# Altium schematic sheet TMC2208.SchDoc
size Letter; SheetNumber: 3; SheetTotal: 3
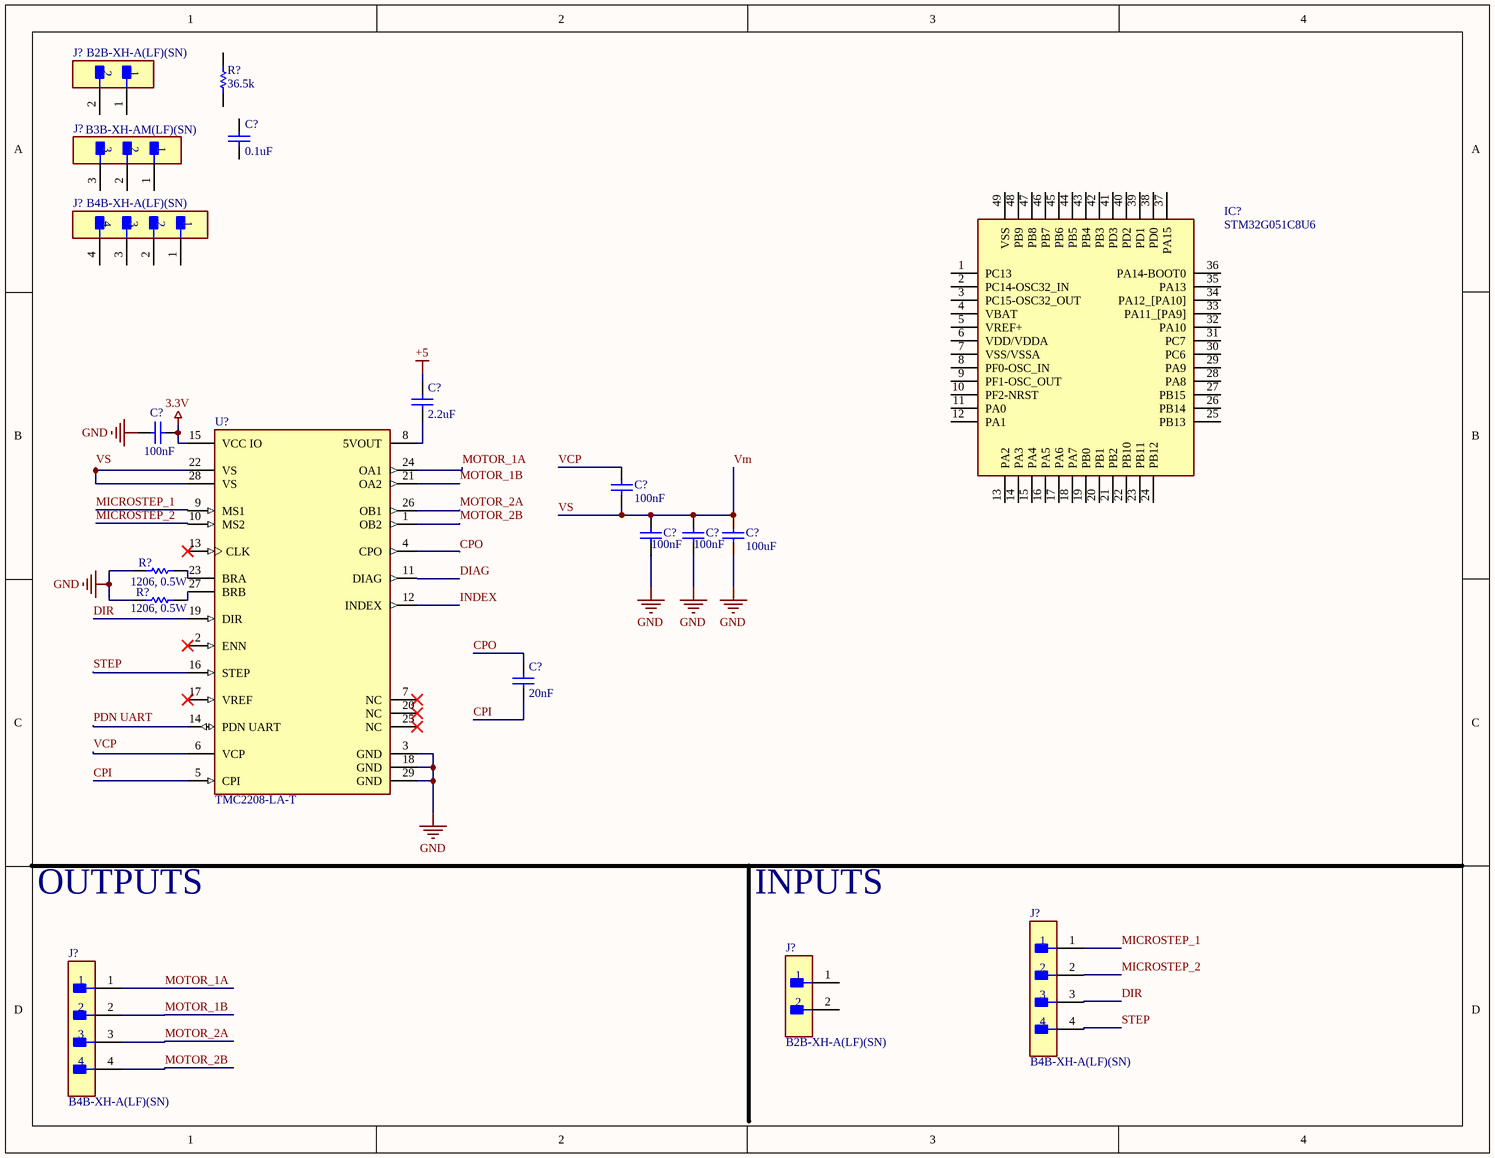
[diagram p0: TMC2208.SchDoc]

## Parts
(Parts that share a designator on the sheet are numbered #1, #2 ... from top to bottom, then left to right.)
C?#1  value 0.1uF  (hidden comment: Capacitor)
C?#2  value 2.2uF  (hidden comment: Capacitor)
C?#3  value 100nF  (hidden comment: Capacitor)
C?#4  value 100nF  (hidden comment: Capacitor)
C?#5  value 100nF  (hidden comment: Capacitor)
C?#6  value 100nF  (hidden comment: Capacitor)
C?#7  value 100uF  (hidden comment: Capacitor)
C?#8  value 20nF  (hidden comment: Capacitor)
IC?  STM32G051C8U6  [QFN50P700X700X65-49N-D]
J?#1  B2B-XH-A(LF)(SN)  [FP-B2B-XH-A_LF_SN-MFG]
J?#2  B3B-XH-AM(LF)(SN)  [FP-B3B-XH-AM_LF_SN-MFG]
J?#3  B4B-XH-A(LF)(SN)  [FP-B4B-XH-A_LF_SN-MFG]
J?#4  B4B-XH-A(LF)(SN)  [FP-B4B-XH-A_LF_SN-MFG]
J?#5  B2B-XH-A(LF)(SN)  [FP-B2B-XH-A_LF_SN-MFG]
J?#6  B4B-XH-A(LF)(SN)  [FP-B4B-XH-A_LF_SN-MFG]
R?#1  value 36.5k  (hidden comment: Resistor)
R?#2  value 1206, 0.5W  (hidden comment: Resistor)
R?#3  value 1206, 0.5W  (hidden comment: Resistor)
U?  TMC2208-LA-T  [FP-TMC2208-LA-T-MFG]

## Nets
3.3V: C?#3.1 U?.15(VCC_IO)
+5: C?#2.2
GND: C?#3.2 C?#5.2 C?#6.2 C?#7.2 R?#2.2 R?#3.1 U?.3(GND) U?.18(GND) U?.29(GND)
CPI: C?#8.1 U?.5(CPI)
CPO: C?#8.2 U?.4(CPO)
DIAG: U?.11(DIAG)
DIR: J?#4.3 U?.19(DIR)
INDEX: U?.12(INDEX)
MICROSTEP_1: J?#4.1 U?.9(MS1)
MICROSTEP_2: J?#4.2 U?.10(MS2)
MOTOR_1A: J?#6.1 U?.24(OA1)
MOTOR_1B: J?#6.2 U?.21(OA2)
MOTOR_2A: J?#6.3 U?.26(OB1)
MOTOR_2B: J?#6.4 U?.1(OB2)
PDN UART: U?.14(PDN_UART)
STEP: J?#4.4 U?.16(STEP)
VCP: C?#4.1 U?.6(VCP)
Vm: C?#4.2 C?#5.1 C?#6.1 C?#7.1 U?.22(VS) U?.28(VS)  [also labelled VS]
NetC?#2_1: C?#2.1 U?.8(5VOUT)
NetR?#2_1: R?#2.1 U?.23(BRA)
NetR?#3_2: R?#3.2 U?.27(BRB)

Not connected (* = marked no-connect by the designer): C?#1 1 2; IC? 1(PC13) 2(PC14-OSC32_IN) 3(PC15-OSC32_OUT) 4(VBAT) 5(VREF+) 6(VDD/VDDA) 7(VSS/VSSA) 8(PF0-OSC_IN) 9(PF1-OSC_OUT) 10(PF2-NRST) 11(PA0) 12(PA1) 13(PA2) 14(PA3) 15(PA4) 16(PA5) 17(PA6) 18(PA7) 19(PB0) 20(PB1) 21(PB2) 22(PB10) 23(PB11) 24(PB12) 25(PB13) 26(PB14) 27(PB15) 28(PA8) 29(PA9) 30(PC6) 31(PC7) 32(PA10) 33(PA11_[PA9]) 34(PA12_[PA10]) 35(PA13) 36(PA14-BOOT0) 37(PA15) 38(PD0) 39(PD1) 40(PD2) 41(PD3) 42(PB3) 43(PB4) 44(PB5) 45(PB6) 46(PB7) 47(PB8) 48(PB9) 49(VSS); J?#1 1 2; J?#2 1 2 3; J?#3 1 2 3 4; J?#5 1 2; R?#1 1 2; U? 2(ENN)* 7(NC)* 13(CLK)* 17(VREF)* 20(NC)* 25(NC)*

## Notes on the sheet
- OUTPUTS
- INPUTS

## Library data of the parts
C?#1-C?#6 C?#8 = Capacitor: SimulationGenericComponent: True
C?#7 = Capacitor: LOW ESR TYPE; SimulationGenericComponent: True
IC? = STM32G051C8U6: Integrated Circuit; Manufacturer_Name: STMicroelectronics; Datasheet Link: https://www.st.com/resource/en/datasheet/stm32g051c6.pdf; Height: 0.65mm; Manufacturer_Part_Number: STM32G051C8U6; Mouser Part Number: 511-STM32G051C8U6; Mouser Price/Stock: https://www.mouser.co.uk/ProductDetail/STMicroelectronics/STM32G051C8U6?qs=CiayqK2gdcKFEs5xzvfb9g%3D%3D; Arrow Part Number: STM32G051C8U6; Arrow Price/Stock: https://www.arrow.com/en/products/stm32g051c8u6/stmicroelectronics?region=nac
J?#1 J?#5 = CMP-2000-05888-3: CONN HEADER VERT 2POS 2.5MM; Current Rating: 3A; Voltage Rating: 250V; Number of Contacts: 2; Contact Resistance: 20mR; Wire/Cable Gauge: 22AWG; Insulation Resistance: 1GR; Connector Type: Male Pin; Packaging: Bulk; Contact Material: Brass; Lead Free: Lead Free; Orientation: Straight; Contact Plating: Tin; Max Current Rating: 3A; Termination: Solder; Fastening Type: Detent; Depth: 5.75mm; Housing Material: Polyamide; REACH SVHC: No SVHC; Series: XH; Voltage Rating (AC): 250V; Number of Positions: 2; Color: Natural; Contact Type: Male Pin; Max Voltage Rating (DC): 250V; Pitch: 2.5mm; Lead Pitch: 2.5mm; Mount: Through Hole; Max Operating Temperature: 85°C; Length: 7.4mm; Max Voltage Rating (AC): 250V; Min Operating Temperature: -25°C; Number of Rows: 1; Housing Color: White
J?#2 = CMP-17438-000009-1: CONN HEADER VERT 3POS 2.5MM; Max Current Rating: 3A; Gender: Male; Max Voltage Rating (AC): 250V; Connector Type: Male Pin; Pitch: 0.098inch; Number of Positions: 3; Contact Resistance: 20mR; Termination: Press-Fit; Housing Color: White; Housing Material: Polyamide; Orientation: Straight; Contact Material: Brass; Contact Type: Male Pin; Color: Natural; Packaging: Bulk; Lead Free: Lead Free; Depth: 5.75mm; Number of Rows: 1; Contact Plating: Tin; Length: 9.9mm; Max Operating Temperature: 85°C; Series: XH; Min Operating Temperature: -25°C; Fastening Type: Detent; Mount: Through Hole
J?#3 J?#4 J?#6 = CMP-17439-000250-1: CONN HEADER VERT 4POS 2.5MM; Number of Contacts: 4; Contact Resistance: 20mR; Voltage Rating: 250V; Max Current Rating: 3A; Gender: Male; Wire/Cable Gauge: 22AWG; Mated Stacking Heights: 9.8mm; Insulation Resistance: 1GR; Orientation: Straight; Contact Type: Male Pin; Contact Finish - Mating: TIN; Series: XH; Max Voltage Rating (AC): 250V; Lead Pitch: 2.5mm; Contact Shape: Square; Insulation Color: Natural; Termination: Solder; Lead Free: Lead Free; Voltage Rating (AC): 250V; Number of Rows: 1; Flammability Rating: UL94 V-0; Number of Positions: 4; Max Operating Temperature: 85°C; Package Quantity: 500; Mount: Through Hole; REACH SVHC: No SVHC; Connector Type: Header; Insulation Material: Nylon; Fastening Type: Detent; Min Operating Temperature: -25°C; Housing Color: White; Packaging: Bulk; Contact Plating: Tin; Contact Material: Brass; Max Voltage Rating (DC): 250V; Housing Material: Polyamide; Color: Natural; Material: Polyamide; Pitch: 2.5mm; Depth: 5.75mm; Current Rating: 3A; Length: 12.4mm
R?#1-R?#3 = Resistor: TC1: 0; SimulationGenericComponent: True; TC2: 0
U? = CMP-237673-000002-1: IC MTR DRV BIPOLAR 5.5-36V 28QFN; Manufacturer: Trinamic; Output Voltage: 5V; Max Supply Voltage: 36V; Motor Type: Stepper; Switching Frequency: 4-18MHz; Max Power Dissipation: 2.5W; Description: IC STEPPER MOTOR DRIVER 28QFN; Nominal Supply Current: 15-7500uA; Min Supply Voltage: 3V; Standoff Height: 0mm; Number Of Outputs: 1; Output Current: 2A; Max Junction Temp: +125°C; Device Class L2: Power Management ICs; Temperature Range High: +125°C; Octopart: https://octopart.com/tmc2208-la-t-trinamic-76983545; Lead Free: Yes; Device Class L3: Motor Drivers; ComponentLink2URL: https://www.trinamic.com/fileadmin/assets/Products/ICs_Documents/TMC220x_TMC222x_datasheet_Rev1.05.pdf; RoHS: TRUE; Manufacturer Part Number: TMC2208-LA-T; Package: TMC2208-LA-T; Ipc Land Pattern Name: QFN50P500X500X85-28; Device Class L1: Integrated Circuits (ICs); Temperature: -40°C to +125°C; Digikey Description: IC MTR DRV BIPOLAR 5.5-36V 28QFN; ComponentLink2Description: Datasheet; Height: 0.9mm; Automotive: No; Category: IC; Temperature Range Low: -40°C